# Altium schematic sheet project_cover.SchDoc
size A3; Engineer: Alperen ÖZKUL; DocumentNumber: 1; SheetNumber: 1; SheetTotal: 5; FIRST_PROJECT: *FIRST_PROJECT; PAGE_SİZE: *A3
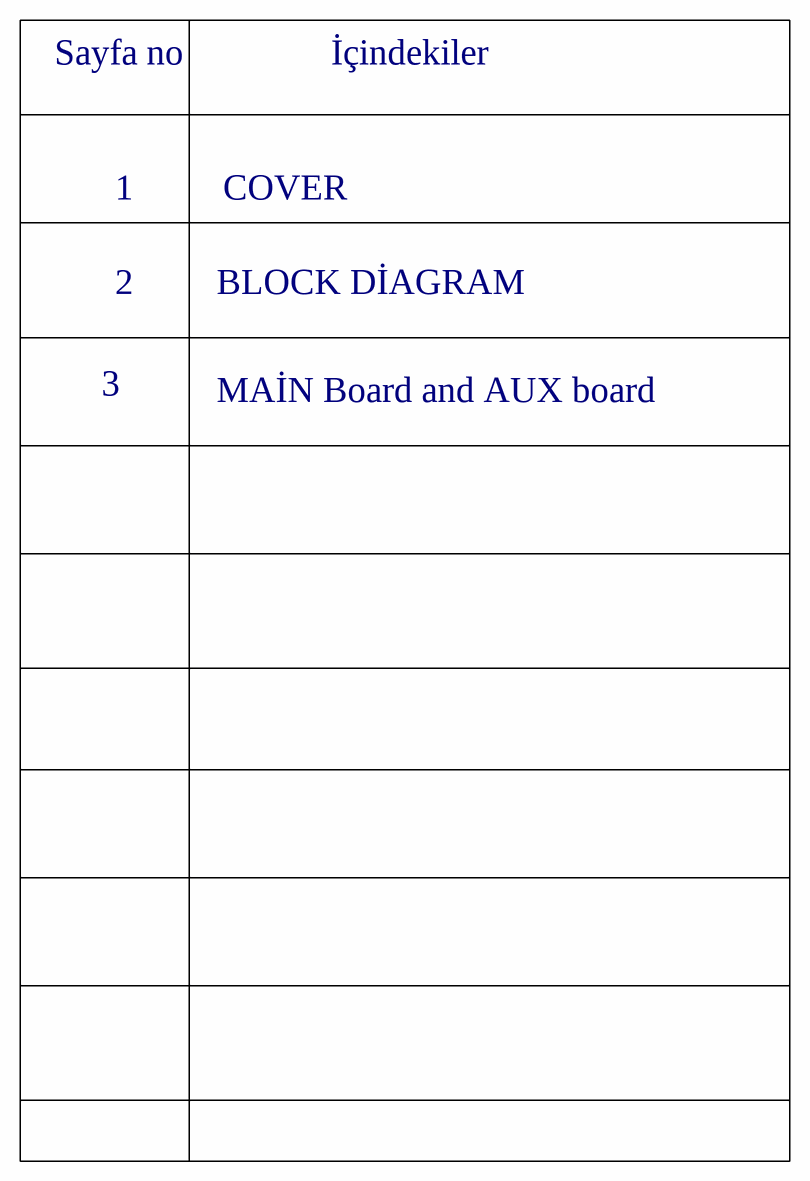
[diagram p0: project_cover.SchDoc]

## Notes on the sheet
- Sayfa no
- İçindekiler
- 1
- COVER
- 2
- BLOCK DİAGRAM
- 3
- MAİN Board and AUX board
- Engineer
- PROJECT_NUMBER
- SIZE
- TITLE
- UNIVERSITY
- DATE:
- SHEET=
- OF